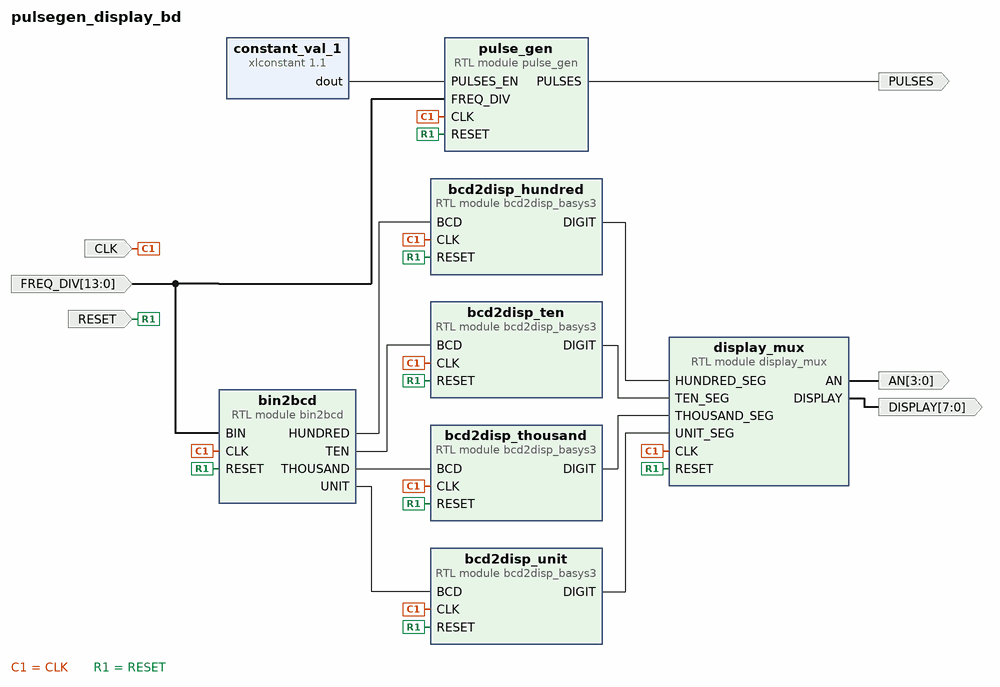
[diagram p0: block diagram of the top level]
# Vivado block design pulsegen_display_bd, xc7a35tcpg236-1, Vivado 2023.2
create_bd_design pulsegen_display_bd

create_bd_port -dir I -type rst RESET
create_bd_port -dir I -type clk CLK
create_bd_port -dir I -from 13 -to 0 FREQ_DIV
create_bd_port -dir O -from 7 -to 0 DISPLAY
create_bd_port -dir O -from 3 -to 0 AN
create_bd_port -dir O PULSES

create_bd_cell -type module -reference bcd2disp_basys3 bcd2disp_unit
create_bd_cell -type module -reference bin2bcd bin2bcd
create_bd_cell -type module -reference display_mux display_mux
create_bd_cell -type module -reference pulse_gen pulse_gen
set_property -dict {CONFIG.G_FREQ_DIV_WIDTH 14} [get_bd_cells pulse_gen]
create_bd_cell -type module -reference bcd2disp_basys3 bcd2disp_ten
create_bd_cell -type module -reference bcd2disp_basys3 bcd2disp_hundred
create_bd_cell -type module -reference bcd2disp_basys3 bcd2disp_thousand
create_bd_cell -type ip -vlnv xilinx.com:ip:xlconstant:1.1 constant_val_1

# ---- connections ----

connect_bd_net -net CLK_0_1 [get_bd_ports CLK] \
  [get_bd_pins pulse_gen/CLK] [get_bd_pins bin2bcd/CLK] [get_bd_pins display_mux/CLK] [get_bd_pins bcd2disp_unit/CLK] \
  [get_bd_pins bcd2disp_ten/CLK] [get_bd_pins bcd2disp_hundred/CLK] [get_bd_pins bcd2disp_thousand/CLK]
connect_bd_net -net FREQ_DIV_0_1 [get_bd_ports FREQ_DIV] [get_bd_pins pulse_gen/FREQ_DIV] [get_bd_pins bin2bcd/BIN]
connect_bd_net -net RESET_0_1 [get_bd_ports RESET] \
  [get_bd_pins pulse_gen/RESET] [get_bd_pins bin2bcd/RESET] [get_bd_pins display_mux/RESET] [get_bd_pins bcd2disp_unit/RESET] \
  [get_bd_pins bcd2disp_ten/RESET] [get_bd_pins bcd2disp_hundred/RESET] [get_bd_pins bcd2disp_thousand/RESET]
connect_bd_net [get_bd_pins bcd2disp_hundred/DIGIT] [get_bd_pins display_mux/HUNDRED_SEG]
connect_bd_net [get_bd_pins bcd2disp_ten/DIGIT] [get_bd_pins display_mux/TEN_SEG]
connect_bd_net [get_bd_pins bcd2disp_thousand/DIGIT] [get_bd_pins display_mux/THOUSAND_SEG]
connect_bd_net [get_bd_pins bcd2disp_unit/DIGIT] [get_bd_pins display_mux/UNIT_SEG]
connect_bd_net [get_bd_pins bin2bcd/HUNDRED] [get_bd_pins bcd2disp_hundred/BCD]
connect_bd_net [get_bd_pins bin2bcd/TEN] [get_bd_pins bcd2disp_ten/BCD]
connect_bd_net [get_bd_pins bin2bcd/THOUSAND] [get_bd_pins bcd2disp_thousand/BCD]
connect_bd_net [get_bd_pins bin2bcd/UNIT] [get_bd_pins bcd2disp_unit/BCD]
connect_bd_net -net display_mux_0_AN [get_bd_pins display_mux/AN] [get_bd_ports AN]
connect_bd_net -net display_mux_0_DISPLAY [get_bd_pins display_mux/DISPLAY] [get_bd_ports DISPLAY]
connect_bd_net [get_bd_pins pulse_gen/PULSES] [get_bd_ports PULSES]
connect_bd_net -net xlconstant_0_dout [get_bd_pins constant_val_1/dout] [get_bd_pins pulse_gen/PULSES_EN]

validate_bd_design
save_bd_design
